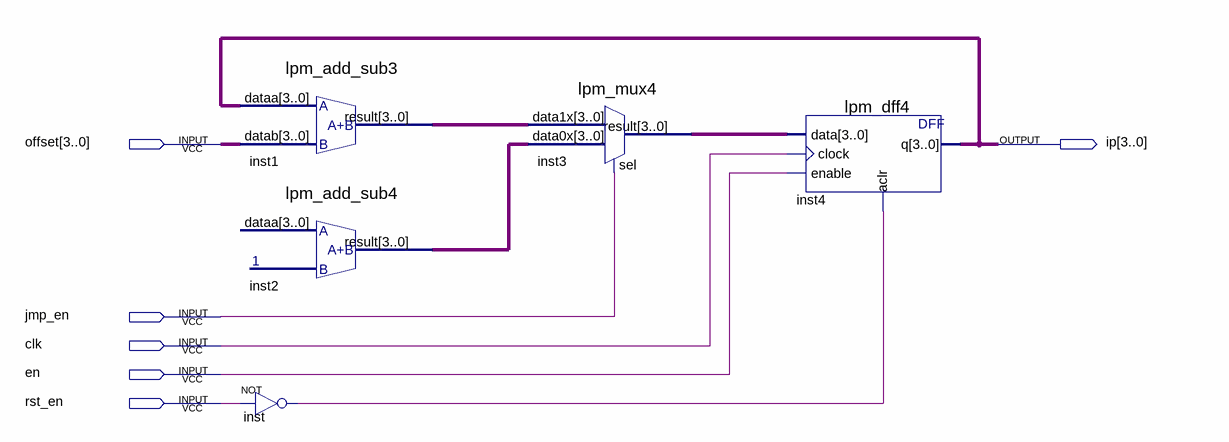
[diagram p0: schematic sheet]
// Quartus schematic ip_unit.bdf as structural Verilog: 5 symbols, 6 pins
module ip_unit (
  input  [3:0] offset,
  input  jmp_en,
  input  clk,
  input  en,
  input  rst_en,
  output [3:0] ip
);

  wire inst_out;
  wire [3:0] inst1_result, inst2_result, inst3_result;

  lpm_add_sub3 inst1 (.dataa(ip), .datab(offset), .result(inst1_result));
  lpm_add_sub4 inst2 (.result(inst2_result));  // open: dataa
  not inst (inst_out, rst_en);
  lpm_mux4 inst3 (.data1x(inst1_result), .data0x(inst2_result), .sel(jmp_en), .result(inst3_result));
  lpm_dff4 inst4 (.data(inst3_result), .clock(clk), .enable(en), .aclr(inst_out), .q(ip));
endmodule
